# Altium project 搅拌机.PrjPcb
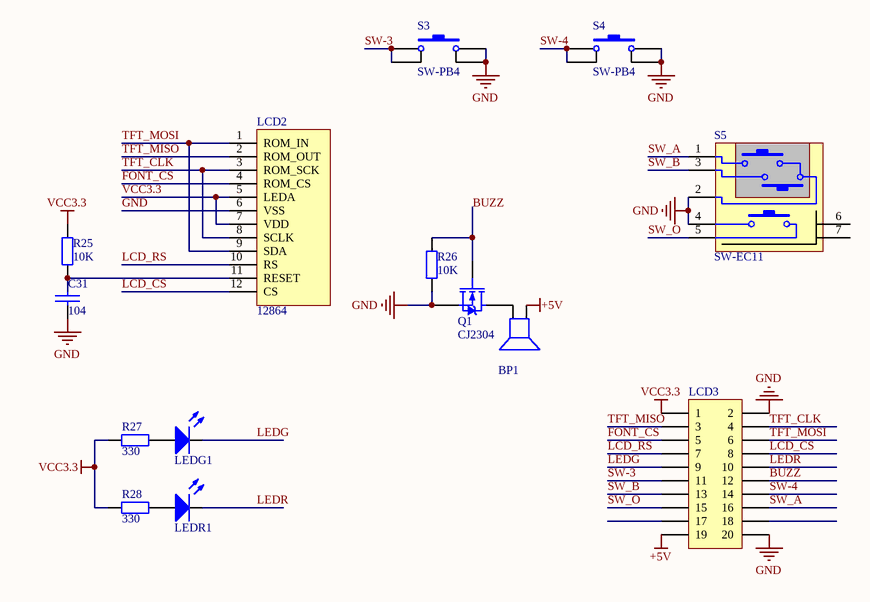
[diagram p0: 显示面板.SchDoc]
6 sheets, 247 parts. Net scope: global (net labels, ports and power ports of the same name join across sheets).
Board files: 显示面板.PcbDoc, 搅拌机主控.PcbDoc, 步进电机驱动板.PcbDoc
Sheets:
  显示面板.SchDoc
  转速检测.SchDoc
  PT100检测电路.SchDoc
  MCU.SchDoc
  搅拌驱动驱动.SchDoc
  升降电机驱动.SchDoc

## Sheet 显示面板.SchDoc
size A4

### Parts
BP1  BUZZER  [蜂鸣器]  (value not drawn)
C31  104  [0603C]
LCD2  12864  [LCD12864-1.7inch]
LCD3  LCD  [HDR10X2_A1]  (value not drawn)
LEDG1  COLOUR  [LEDφ6]  (value not drawn)
LEDR1  COLOUR  [LEDφ6]  (value not drawn)
Q1  CJ2304  [SOT-23]
R25  value 10K  [0603-1]  (hidden comment: Res1)
R26  value 10K  [0603-1]  (hidden comment: Res1)
R27  value 330  [0603-1]  (hidden comment: Res1)
R28  value 330  [0603-1]  (hidden comment: Res1)
S3  SW-PB4  [SW_PB4_A1]
S4  SW-PB4  [SW_PB4_A1]
S5  SW-EC11  [EC11]

### Nets
+5V: BP1.1(+) LCD3.19
GND: C31.1 LCD2.6(VSS) LCD3.2 LCD3.20 Q1.2(S) R26.1 S3.2 S3.3 S4.2 S4.3 S5.2 S5.4
VCC3.3: LCD2.5(LEDA) LCD2.7(VDD) LCD3.1 R25.2 R27.2 R28.2
BUZZ: LCD3.12 Q1.1(G) R26.2
FONT_CS: LCD2.4(ROM_CS) LCD3.5
LCD_CS: LCD2.12(CS) LCD3.8
LCD_RS: LCD2.10(RS) LCD3.7
LEDG: LCD3.9 LEDG1.2(-)
LEDR: LCD3.10 LEDR1.2(-)
SW-3: LCD3.11 S3.1 S3.4
SW-4: LCD3.14 S4.1 S4.4
SW_A: LCD3.16 S5.1
SW_B: LCD3.13 S5.3
SW_O: LCD3.15 S5.5
TFT_CLK: LCD2.3(ROM_SCK) LCD2.8(SCLK) LCD3.4
TFT_MISO: LCD2.2(ROM_OUT) LCD3.3
TFT_MOSI: LCD2.1(ROM_IN) LCD2.9(SDA) LCD3.6
NetBP1_2: BP1.2(-) Q1.3(D)
NetC31_2: C31.2 LCD2.11(RESET) R25.1
NetLEDG1_1: LEDG1.1(+) R27.1
NetLEDR1_1: LEDR1.1(+) R28.1

Not connected (* = marked no-connect by the designer): LCD3 17 18; S5 6 7

### Library data of the parts
BP1 = BUZZER: 蜂鸣器
C31 = CAP X: 安规电容
LCD2 = LCD12864串口屏: 1.7寸SPI12864屏; 链接: https://item.taobao.com/item.htm?id=12879087349&ali_refid=a3_430582_1006:1103967305:N:12864:66eadc08ff72364ec7fad7a9c6eab1e1&ali_trackid=1_66eadc08ff72364ec7fad7a9c6eab1e1&spm=a230r.1.14.3#detail
LCD3 = Header 10X2: Header, 10-Pin; LatestRevisionDate: 17-Jul-2002; LatestRevisionNote: Re-released for DXP Platform.; Publisher: Altium Limited
LEDG1 LEDR1 = ledφ6
Q1 = MOSFET-N: N-Channel MOSFET; PackageDocument: 1995/1996; Published: 8-Jun-2000; LatestRevisionDate: 17-Jul-2002; LatestRevisionNote: Re-released for DXP Platform.; PackageReference: E3; Publisher: Altium Limited
R25-R28 = Res1: 贴片电阻; Published: 8-Jun-2000; LatestRevisionDate: 17-Jul-2002; LatestRevisionNote: Re-released for DXP Platform.; PackageReference: AXIAL-0.4; Publisher: Altium Limited
S3 S4 = SW-PB4: 微动开关; Published: 24-Mar-1999; LatestRevisionDate: 17-Jul-2002; LatestRevisionNote: Re-released for DXP Platform.; PackageReference: SPST-2; Publisher: Altium Limited
S5 = SW-EC11: 旋转编码开关; Published: 24-Mar-1999; LatestRevisionDate: 17-Jul-2002; LatestRevisionNote: Re-released for DXP Platform.; PackageReference: SPST-2; Publisher: Altium Limited

## Sheet 转速检测.SchDoc
size A4
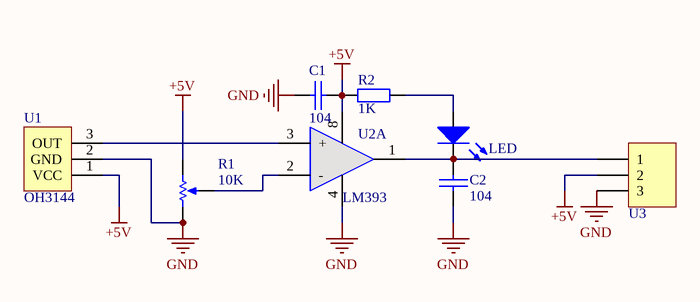
[diagram p1: 转速检测.SchDoc]

### Parts
(Parts that share a designator on the sheet are numbered #1, #2 ... from top to bottom, then left to right.)
C1#1  104  [0603C]
C2#1  104  [0603C]
LED  COLOUR  [0603LED]  (value not drawn)
R1#1  value 10K  [3x3dianweiqi]  (hidden comment: RPot)
R2#1  value 1K  [0603-1]  (hidden comment: Res1)
U1#1  OH3144  [OH3144]
U2#1  LM393  [NSO8_N]  (part A of 2)
U3#1  Header 3  [HDR3X1_A]  (value not drawn)

### Nets
+5V: C1#1.2 R1#1.3(BOT) R2#1.1 U1#1.1(VCC) U2#1.8(V+) U3#1.2
GND: C1#1.1 C2#1.1 R1#1.1(TOP) U1#1.2(GND) U2#1.4(V-) U3#1.3
NetC2#1_2: C2#1.2 LED.2(-) U2#1.1(OUT1) U3#1.1
NetLED_1: LED.1(+) R2#1.2
NetR1#1_2: R1#1.2(TAP) U2#1.2(-)
NetU1#1_3: U1#1.3(OUT) U2#1.3(+)

### Library data of the parts
C1#1 C2#1 = CAP X: 安规电容
LED = ledφ6
R1#1 = RPot: 精密可调电阻; Sim Note: Enter the Resistance value and the set point into parameter fields.; Set Position: 0.5; Published: 8-Jun-2000; LatestRevisionDate: 17-Jul-2002; LatestRevisionNote: Re-released for DXP Platform.; PackageReference: VR5; Publisher: Altium Limited
R2#1 = Res1: 贴片电阻; Published: 8-Jun-2000; LatestRevisionDate: 17-Jul-2002; LatestRevisionNote: Re-released for DXP Platform.; PackageReference: AXIAL-0.4; Publisher: Altium Limited
U1#1 = OH3144: 国产霍尔开关
U2#1 = LM393: 比较器
U3#1 = Header 3: 接插件; LatestRevisionDate: 17-Jul-2002; LatestRevisionNote: Re-released for DXP Platform.; Publisher: Altium Limited

## Sheet PT100检测电路.SchDoc
size A4
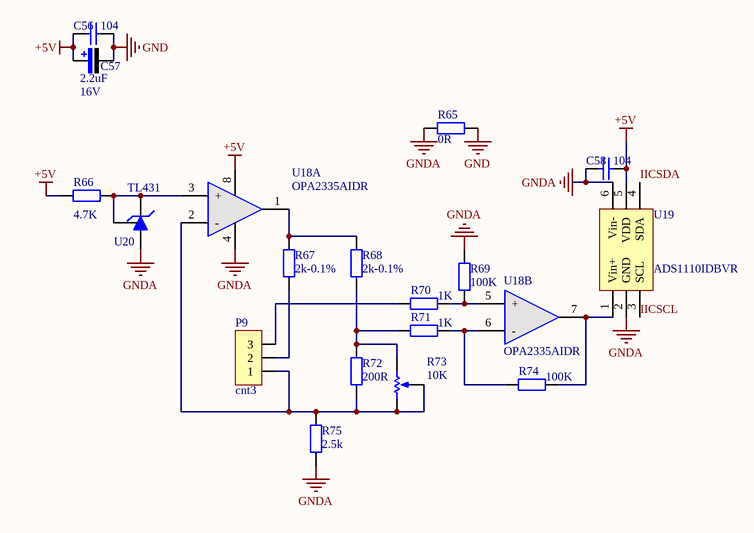
[diagram p2: PT100检测电路.SchDoc]

### Parts
C56  value 104  [C-RAD-0603]  (hidden comment: Cap)
C57  value 2.2uF  Vol: 16V  [CAP-3216]  (hidden comment: Cap Pol)
C58  value 104  [C-RAD-0603]  (hidden comment: Cap)
P9  cnt3  [7.62mmPCB接线端子3p]
R65  value 0R  [0603-1]  (hidden comment: Res1)
R66  value 4.7K  [0603-1]  (hidden comment: Res1)
R67  value 2k-0.1%  [0603-1]  (hidden comment: Res1)
R68  value 2k-0.1%  [0603-1]  (hidden comment: Res1)
R69  value 100K  [0603-1]  (hidden comment: Res1)
R70  value 1K  [0603-1]  (hidden comment: Res1)
R71  value 1K  [0603-1]  (hidden comment: Res1)
R72  value 200R  [0603-1]  (hidden comment: Res1)
R73  value 10K  [VR-3266W]  (hidden comment: RPot)
R74  value 100K  [0603-1]  (hidden comment: Res1)
R75  value 2.5k  [0603-1]  (hidden comment: Res1)
U18  OPA2335AIDR  [NSO8_N]  (parts A,B of 2)
U19  ADS1110IDBVR  [SOT23-6]
U20  TL431  [SOT23]

### Nets
+5V: C56.1 C57.1 C58.2 R66.1 U18.8(V+) U19.5(VDD)
GND: C56.2 C57.2 R65.1
GNDA: C58.1 R65.2 R69.2 R75.1 U18.4(V-) U19.2(GND) U19.6(Vin-) U20.3
IICSCL: U19.3(SCL)
IICSDA: U19.4(SDA)
NetP9_1: P9.1 R72.1 R73.1(TOP) R73.2(TAP) R75.2 U18.2(-)
NetP9_2: P9.2 R67.1
NetP9_3: P9.3 R70.1
NetR66_2: R66.2 U18.3(+) U20.1 U20.2
NetR67_2: R67.2 R68.2 U18.1(OUT1)
NetR68_1: R68.1 R71.1 R72.2 R73.3(BOT)
NetR69_1: R69.1 R70.2 U18.5(+)
NetR71_2: R71.2 R74.1 U18.6(-)
NetR74_2: R74.2 U18.7(OUT2) U19.1(Vin+)

### Library data of the parts
C56 C58 = Cap: 无极性电容; Published: 8-Jun-2000; LatestRevisionDate: 17-Jul-2002; LatestRevisionNote: Re-released for DXP Platform.; PackageReference: RAD-0.3; Publisher: Altium Limited
C57 = Cap Pol: 极性电解电容; Published: 8-Jun-2000; LatestRevisionDate: 17-Jul-2002; LatestRevisionNote: Re-released for DXP Platform.; PackageReference: RB7.6-15; Publisher: Altium Limited
P9 = cnt3: 3p接线端子
R65-R72 R74 R75 = Res1: 贴片电阻; Published: 8-Jun-2000; LatestRevisionDate: 17-Jul-2002; LatestRevisionNote: Re-released for DXP Platform.; PackageReference: AXIAL-0.4; Publisher: Altium Limited
R73 = RPot: as R1#1 on sheet 转速检测; Published: 8-Jun-2000; LatestRevisionDate: 17-Jul-2002; LatestRevisionNote: Re-released for DXP Platform.; PackageReference: VR5; Publisher: Altium Limited
U18 = AD8667: 双运放
U19 = ADS1110IDBVR: 16位内部基准AD芯片IIC

## Sheet MCU.SchDoc
size A3
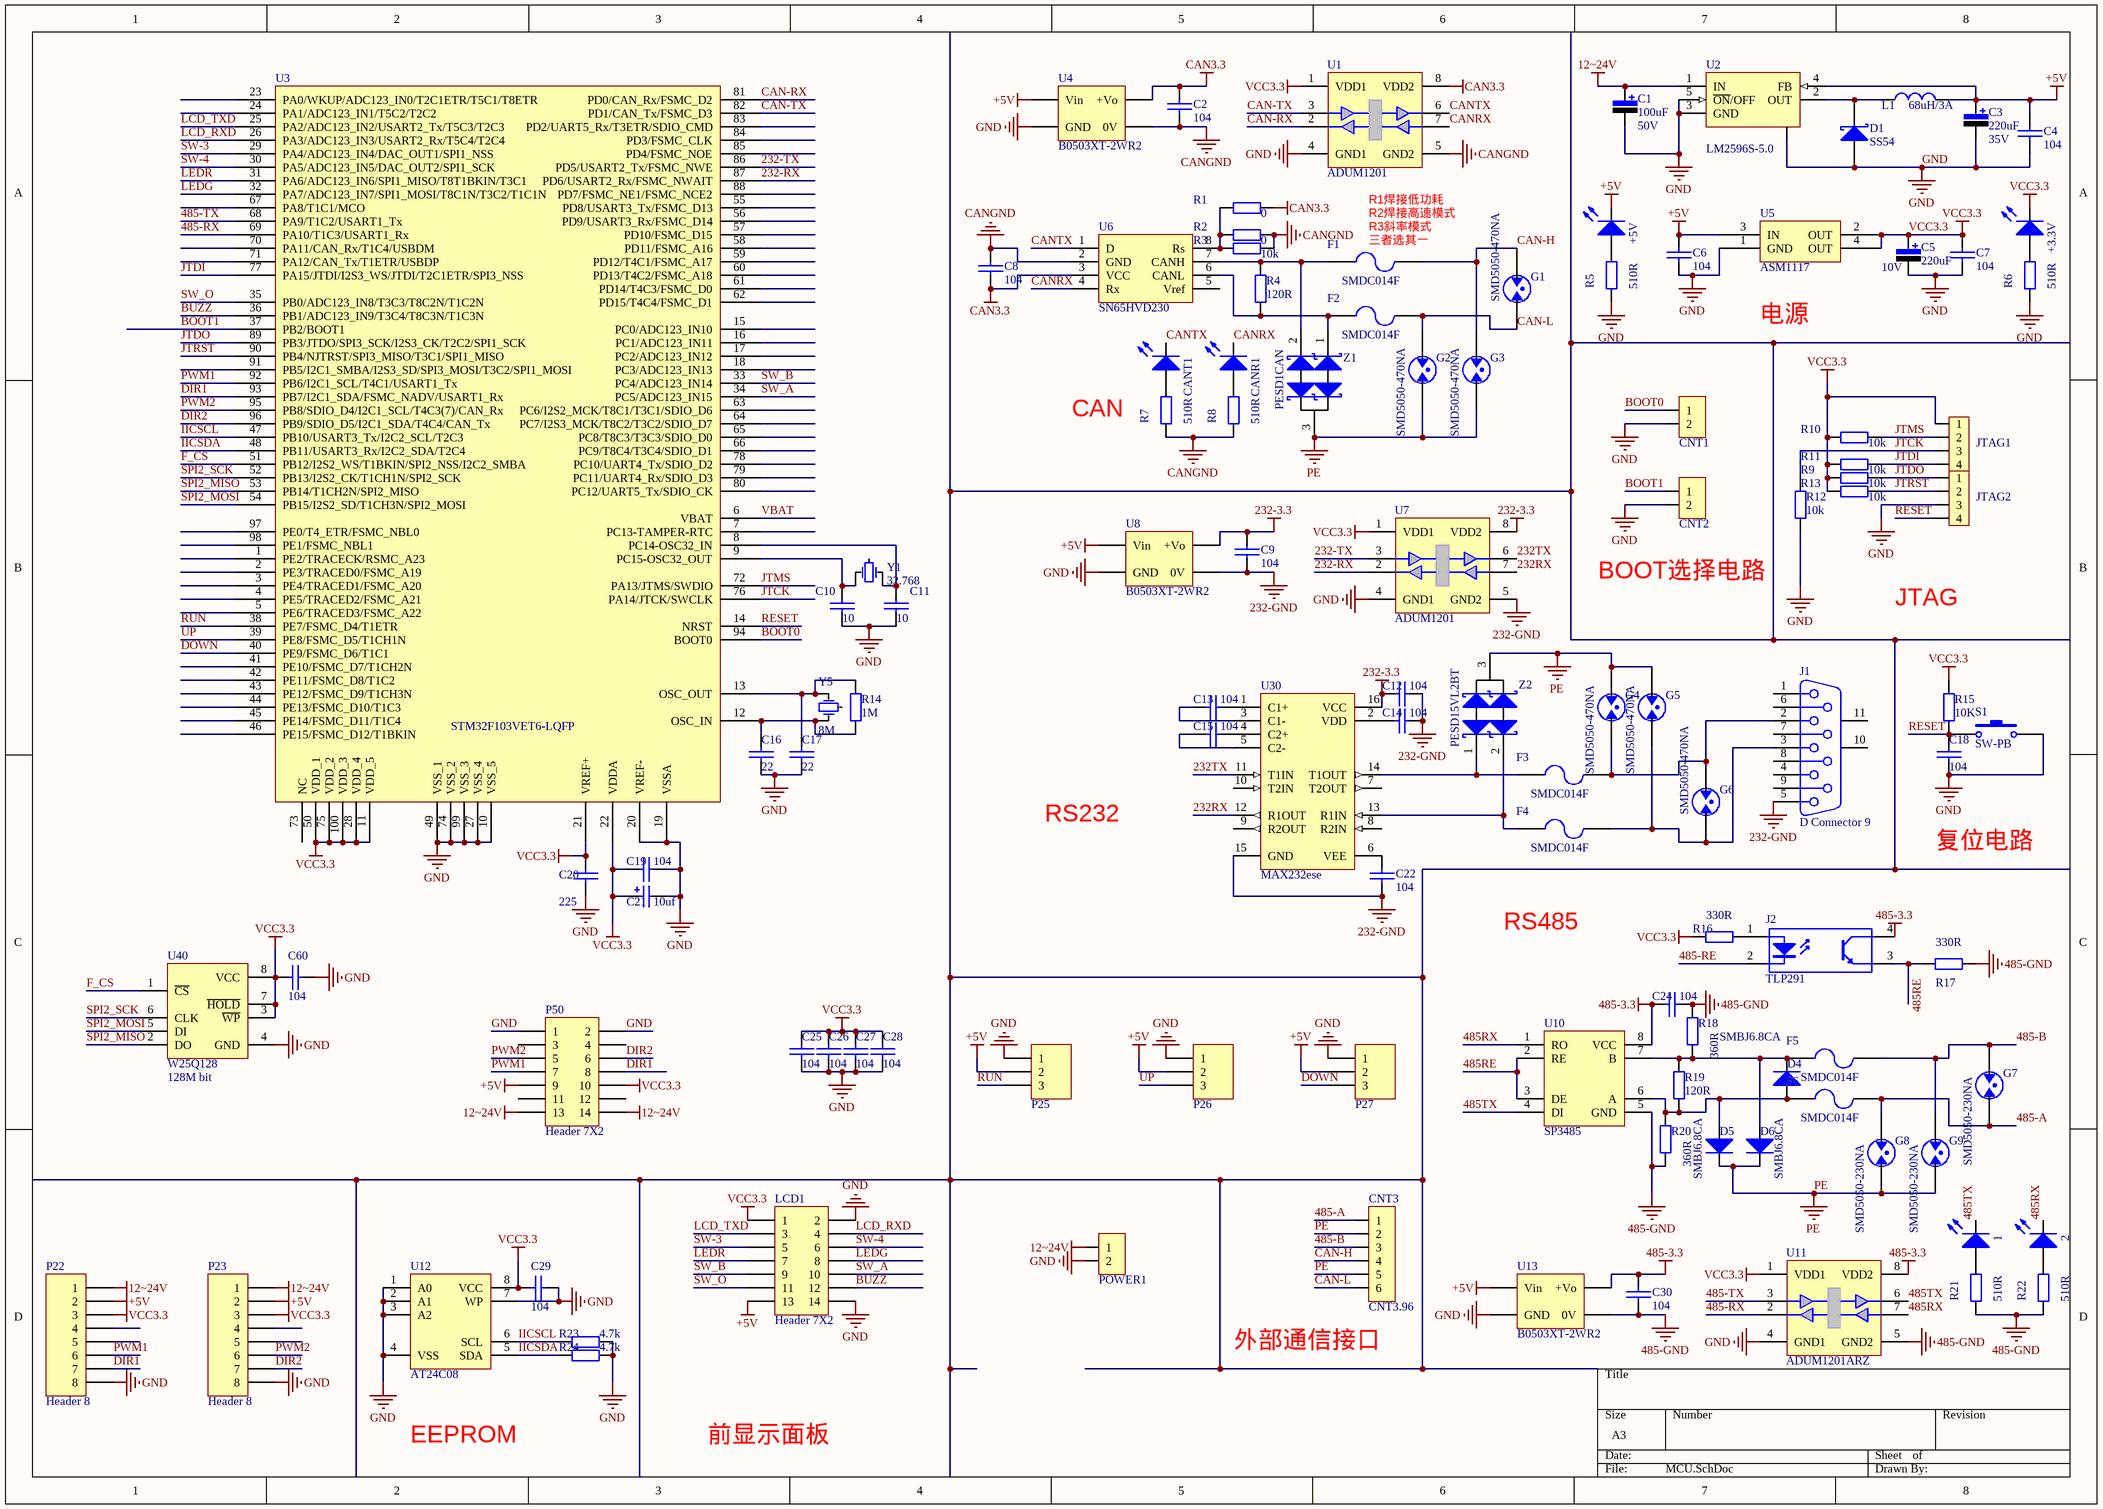
[diagram p3: MCU.SchDoc]

### Parts
(Parts that share a designator on the sheet are numbered #1, #2 ... from top to bottom, then left to right.)
1  COLOUR  [0603LED]  (value not drawn)
2  COLOUR  [0603LED]  (value not drawn)
+3.3V  COLOUR  [0603LED]  (value not drawn)
+5V  COLOUR  [0603LED]  (value not drawn)
C1#2  value 100uF  Vol: 50V  [C-RB-S10]  (hidden comment: Cap Pol)
C2#2  104  [0603C]
C3  value 220uF  Vol: 35V  [C-RB-S10]  (hidden comment: Cap Pol)
C4  104  [0603C]
C5  value 220uF  Vol: 10V  [CAP-7343]  (hidden comment: Cap Pol)
C6  104  [0603C]
C7  104  [0603C]
C8  104  [0603C]
C9  104  [0603C]
C10  10  [0603C]
C11  10  [0603C]
C12  104  [0603C]
C13  104  [0603C]
C14  104  [0603C]
C15  104  [0603C]
C16  22  [0603C]
C17  22  [0603C]
C18  104  [0603C]
C19  104  [0603C]
C20  225  [0603C]
C21  10uf  [ct3216-18]
C22  104  [0603C]
C24  104  [0603C]
C25  104  [0603C]
C26  104  [0603C]
C27  104  [0603C]
C28  104  [0603C]
C29  104  [0603C]
C30  104  [0603C]
C60  104  [0603C]
CANR1  COLOUR  [0603LED]  (value not drawn)
CANT1  COLOUR  [0603LED]  (value not drawn)
CNT1  cnt2p  [cont-1]  (value not drawn)
CNT2  cnt2p  [cont-1]  (value not drawn)
CNT3  CNT3.96  [CNT3.96]
D1  Type: SS54  [DIODE-SMA]  (hidden comment: D-Schottky)
D4  Type: SMBJ6.8CA  [DIODE-SMB]  (hidden comment: TVS)
D5  Type: SMBJ6.8CA  [DIODE-SMB]  (hidden comment: TVS)
D6  Type: SMBJ6.8CA  [DIODE-SMB]  (hidden comment: TVS)
F1  SMDC014F  [1812]
F2  value SMDC014F  [1812]  (hidden comment: Fuse)
F3  SMDC014F  [1812]
F4  value SMDC014F  [1812]  (hidden comment: Fuse)
F5  SMDC014F  [1812]
F6  value SMDC014F  [1812]  (hidden comment: Fuse)
G1  SMD5050-470NA  [SMD5050]
G2  SMD5050-470NA  [SMD5050]
G3  SMD5050-470NA  [SMD5050]
G4  SMD5050-470NA  [SMD5050]
G5  SMD5050-470NA  [SMD5050]
G6  SMD5050-470NA  [SMD5050]
G7  SMD5050-230NA  [SMD5050]
G8  SMD5050-230NA  [SMD5050]
G9  SMD5050-230NA  [SMD5050]
J1  D Connector 9  [DB9-M]
J2  TLP291  [SOP127P710X350-4N]
JTAG1  单排插针11mm4p  [单排插针2.54]  (value not drawn)
JTAG2  单排插针11mm4p  [单排插针2.54]  (value not drawn)
L1  value 68uH/3A  [L-SMD-12]  (hidden comment: Inductor)
LCD1  Header 7X2  [HDR7X2_A1]
P22  Header 8  [PH2.0-8P]
P23  Header 8  [PH2.0-8P]
P25  Header 3  [XH2.54*3卧贴]  (value not drawn)
P26  Header 3  [XH2.54*3卧贴]  (value not drawn)
P27  Header 3  [XH2.54*3卧贴]  (value not drawn)
P50  Header 7X2  [HDR7X2_A1]
POWER1  CNT5.08MM*2 WAN  [CNT5.08*2WAN]  (value not drawn)
R1#2  value 0  [0603-1]  (hidden comment: Res1)
R2#2  value 0  [0603-1]  (hidden comment: Res1)
R3  value 10k  [0603-1]  (hidden comment: Res1)
R4  value 120R  [0603-1]  (hidden comment: Res1)
R5  value 510R  [0603-1]  (hidden comment: Res1)
R6  value 510R  [0603-1]  (hidden comment: Res1)
R7  value 510R  [0603-1]  (hidden comment: Res1)
R8  value 510R  [0603-1]  (hidden comment: Res1)
R9  value 10k  [0603-1]  (hidden comment: Res1)
R10  value 10k  [0603-1]  (hidden comment: Res1)
R11  value 10k  [0603-1]  (hidden comment: Res1)
R12  value 10k  [0603-1]  (hidden comment: Res1)
R13  value 10k  [0603-1]  (hidden comment: Res1)
R14  value 1M  [0603-1]  (hidden comment: Res1)
R15  value 10K  [0603-1]  (hidden comment: Res1)
R16  value 330R  [0603-1]  (hidden comment: Res1)
R17  value 330R  [0603-1]  (hidden comment: Res1)
R18  value 360R  [0603-1]  (hidden comment: Res1)
R19  value 120R  [0603-1]  (hidden comment: Res1)
R20  value 360R  [0603-1]  (hidden comment: Res1)
R21  value 510R  [0603-1]  (hidden comment: Res1)
R22  value 510R  [0603-1]  (hidden comment: Res1)
R23  value 4.7k  [0603-1]  (hidden comment: Res1)
R24  value 4.7k  [0603-1]  (hidden comment: Res1)
S1  SW-PB  [SW_PB4_A1]
U1#2  ADUM1201  [NSO8_N]
U2#2  LM2596S-5.0  [TO-263-5]
U3#2  STM32F103VET6-LQFP  [LQFP-100_M]
U4  B0503XT-2WR2  [B_XT-2WR2]
U5  ASM1117  [SOT-223]
U6  SN65HVD230  [NSO8_N]
U7  ADUM1201  [NSO8_N]
U8  B0503XT-2WR2  [B_XT-2WR2]
U10  SP3485  [NSO8_N]
U11  ADUM1201ARZ  [NSO8_N]
U12  AT24C08  [SOIC8_N]
U13  B0503XT-2WR2  [B_XT-2WR2]
U30  MAX232ese  [NSO16_M]
U40  W25Q128  Memory: 128M bit  [SOIC8_W]
Y1  value 32.768  [MC-146]  (hidden comment: XTAL_SM)
Y5  value 8M  [xtal3225]  (hidden comment: XTAL_SM)
Z1  PESD1CAN  [SOT-23]
Z2  PESD15VL2BT  [SOT-23]

### Nets
12~24V: C1#2.1 P22.1 P23.1 P50.13 P50.14 POWER1.1 U2#2.1(IN)
232-3.3: C9.1 C12.2 U7.8(VDD2) U8.9(+Vo) U30.16(VCC)
232-GND: C9.2 C12.1 C14.1 C22.1 J1.5 U7.5(GND2) U8.8(0V) U30.15(GND)
485-3.3: C24.2 C30.1 J2.4(C) U10.8(VCC) U11.8(VDD2) U13.9(+Vo)
485-GND: C24.1 C30.2 R17.1 R18.2 R20.1 R21.1 R22.1 U10.5(GND) U11.5(GND2) U13.8(0V)
+5V: +5V.2(-) C3.1 C4.1 C6.1 L1.2 LCD1.13 P22.2 P23.2 P25.2 P26.2 P27.2 P50.9 U2#2.4(FB) U4.14(Vin) U5.3(IN) U8.14(Vin) U13.14(Vin)
CAN3.3: C2#2.1 C8.2 R1#2.1 U1#2.8(VDD2) U4.9(+Vo) U6.3(VCC)
CANGND: C2#2.2 C8.1 R2#2.1 R3.1 R7.1 R8.1 U1#2.5(GND2) U4.8(0V) U6.2(GND)
GND: C1#2.2 C3.2 C4.2 C5.2 C6.2 C7.2 C10.2 C11.2 C16.2 C17.2 C18.1 C19.1 C20.1 C21.2 C25.1 C26.1 C27.1 C28.1 C29.1 C60.1 CNT1.2 CNT2.2 D1.1(A) JTAG2.3 LCD1.2 LCD1.14 P22.8 P23.8 P25.1 P26.1 P27.1 P50.1 P50.2 POWER1.2 R5.1 R6.1 R12.2 R23.1 R24.1 S1.2 U1#2.4(GND1) U2#2.3(GND) U2#2.5(~{ON}/OFF) U2#2.6 U3#2.10(VSS_5) U3#2.19(VSSA) U3#2.20(VREF-) U3#2.27(VSS_4) U3#2.49(VSS_1) U3#2.74(VSS_2) U3#2.99(VSS_3) U4.1(GND) U5.1(GND) U7.4(GND1) U8.1(GND) U11.4(GND1) U12.1(A0) U12.2(A1) U12.3(A2) U12.4(VSS) U12.7(WP) U13.1(GND) U40.4(GND)
PE: CNT3.2 CNT3.5 D5.2(K) D6.2(K) G2.2 G3.2 G4.1 G5.1 G8.2 G9.2 Z1.3 Z2.3
VCC3.3: +3.3V.2(-) C5.1 C7.1 C19.2 C20.2 C21.1 C25.2 C26.2 C27.2 C28.2 C29.2 C60.2 JTAG1.1 LCD1.1 P22.3 P23.3 P50.10 R9.2 R10.2 R11.2 R13.2 R15.2 R16.2 U1#2.1(VDD1) U3#2.11(VDD_5) U3#2.21(VREF+) U3#2.22(VDDA) U3#2.28(VDD_4) U3#2.50(VDD_1) U3#2.75(VDD_2) U3#2.100(VDD_3) U5.2(OUT) U5.4(OUT) U7.1(VDD1) U11.1(VDD1) U12.8(VCC) U40.3(~{WP}) U40.7(~{HOLD}) U40.8(VCC)
232-RX: U3#2.87(PD6/USART2_Rx/FSMC_NWAIT) U7.2(Voa)
232-TX: U3#2.86(PD5/USART2_Tx/FSMC_NWE) U7.3(Vib)
232RX: U7.7(Via) U30.12(R1OUT)
232TX: U7.6(Vob) U30.11(T1IN)
485-A: CNT3.1 F6.2 G7.2 G8.1
485-B: CNT3.3 F5.2 G7.1 G9.1
485-RE: J2.2(K)
485-RX: U3#2.69(PA10/T1C3/USART1_Rx) U11.2(Voa)
485-TX: U3#2.68(PA9/T1C2/USART1_Tx) U11.3(Vib)
485RE: J2.3(E) R17.2 U10.2(RE) U10.3(DE)
485RX: 2.2(-) U10.1(RO) U11.7(Via)
485TX: 1.2(-) U10.4(DI) U11.6(Vob)
BOOT0: CNT1.1 U3#2.94(BOOT0)
BOOT1: CNT2.1 U3#2.37(PB2/BOOT1)
BUZZ: LCD1.12 U3#2.36(PB1/ADC123_IN9/T3C4/T8C3N/T1C3N)
CAN-H: CNT3.4 F1.2 G1.1 G3.1
CAN-L: CNT3.6 F2.2 G1.2 G2.1
CAN-RX: U1#2.2(Voa) U3#2.81(PD0/CAN_Rx/FSMC_D2)
CAN-TX: U1#2.3(Vib) U3#2.82(PD1/CAN_Tx/FSMC_D3)
CANRX: CANR1.2(-) U1#2.7(Via) U6.4(Rx)
CANTX: CANT1.2(-) U1#2.6(Vob) U6.1(D)
DIR1: P22.7 P50.8 U3#2.93(PB7/I2C1_SDA/FSMC_NADV/USART1_Rx)
DIR2: P23.7 P50.6 U3#2.96(PB9/SDIO_D5/I2C1_SDA/T4C4/CAN_Tx)
DOWN: P27.3 U3#2.40(PE9/FSMC_D6/T1C1)
F_CS: U3#2.51(PB12/I2S2_WS/T1BKIN/SPI2_NSS/I2C2_SMBA) U40.1(~{CS})
IICSCL: R23.2 U3#2.47(PB10/USART3_Tx/I2C2_SCL/T2C3) U12.6(SCL)
IICSDA: R24.2 U3#2.48(PB11/USART3_Rx/I2C2_SDA/T2C4) U12.5(SDA)
JTCK: JTAG1.3 R12.1 U3#2.76(PA14/JTCK/SWCLK)
JTDI: JTAG1.4 R11.1 U3#2.77(PA15/JTDI/I2S3_WS/JTDI/T2C1ETR/SPI3_NSS)
JTDO: JTAG2.1 R9.1 U3#2.89(PB3/JTDO/SPI3_SCK/I2S3_CK/T2C2/SPI1_SCK)
JTMS: JTAG1.2 R10.1 U3#2.72(PA13/JTMS/SWDIO)
JTRST: JTAG2.2 R13.1 U3#2.90(PB4/NJTRST/SPI3_MISO/T3C1/SPI1_MISO)
LCD_RXD: LCD1.4 U3#2.26(PA3/ADC123_IN3/USART2_Rx/T5C4/T2C4)
LCD_TXD: LCD1.3 U3#2.25(PA2/ADC123_IN2/USART2_Tx/T5C3/T2C3)
LEDG: LCD1.8 U3#2.32(PA7/ADC123_IN7/SPI1_MOSI/T8C1N/T3C2/T1C1N)
LEDR: LCD1.7 U3#2.31(PA6/ADC123_IN6/SPI1_MISO/T8T1BKIN/T3C1)
PWM1: P22.6 P50.7 U3#2.92(PB6/I2C1_SCL/T4C1/USART1_Tx)
PWM2: P23.6 P50.5 U3#2.95(PB8/SDIO_D4/I2C1_SCL/T4C3(7)/CAN_Rx)
RESET: C18.2 JTAG2.4 R15.1 S1.1 U3#2.14(NRST)
RUN: P25.3 U3#2.38(PE7/FSMC_D4/T1ETR)
SPI2_MISO: U3#2.53(PB14/T1CH2N/SPI2_MISO) U40.2(DO)
SPI2_MOSI: U3#2.54(PB15/I2S2_SD/T1CH3N/SPI2_MOSI) U40.5(DI)
SPI2_SCK: U3#2.52(PB13/I2S2_CK/T1CH1N/SPI2_SCK) U40.6(CLK)
SW-3: LCD1.5 U3#2.29(PA4/ADC123_IN4/DAC_OUT1/SPI1_NSS)
SW-4: LCD1.6 U3#2.30(PA5/ADC123_IN5/DAC_OUT2/SPI1_SCK)
SW_A: LCD1.10 U3#2.34(PC5/ADC123_IN15)
SW_B: LCD1.9 U3#2.33(PC4/ADC123_IN14)
SW_O: LCD1.11 U3#2.35(PB0/ADC123_IN8/T3C3/T8C2N/T1C2N)
UP: P26.3 U3#2.39(PE8/FSMC_D5/T1CH1N)
VBAT: U3#2.6(VBAT)
Net1_1: 1.1(+) R21.2
Net2_1: 2.1(+) R22.2
Net+3.3V_1: +3.3V.1(+) R6.2
Net+5V_1: +5V.1(+) R5.2
NetC10_1: C10.1 U3#2.9(PC15-OSC32_OUT) Y1.1(OSC1)
NetC11_1: C11.1 U3#2.8(PC14-OSC32_IN) Y1.2(OSC2)
NetC13_1: C13.1 U30.1(C1+)
NetC13_2: C13.2 U30.3(C1-)
NetC14_2: C14.2 U30.2(VDD)
NetC15_1: C15.1 U30.4(C2+)
NetC15_2: C15.2 U30.5(C2-)
NetC16_1: C16.1 R14.1 U3#2.12(OSC_IN) Y5.1(OSC1)
NetC17_1: C17.1 R14.2 U3#2.13(OSC_OUT) Y5.2(OSC2)
NetC22_2: C22.2 U30.6(VEE)
NetCANR1_1: CANR1.1(+) R8.2
NetCANT1_1: CANT1.1(+) R7.2
NetD1_2: D1.2(K) L1.1 U2#2.2(OUT)
NetD4_1: D4.1(A) D5.1(A) F6.1 R19.1 R20.2 U10.6(A)
NetD4_2: D4.2(K) D6.1(A) F5.1 R18.1 R19.2 U10.7(B)
NetF1_1: F1.1 R4.2 U6.7(CANH) Z1.2
NetF2_1: F2.1 R4.1 U6.6(CANL) Z1.1
NetF3_1: F3.1 U30.14(T1OUT) Z2.1
NetF3_2: F3.2 G4.2 G6.1 J1.2
NetF4_1: F4.1 U30.13(R1IN) Z2.2
NetF4_2: F4.2 G5.2 G6.2 J1.3
NetJ2_1: J2.1(A) R16.1
NetR1#2_2: R1#2.2 R2#2.2 R3.2 U6.8(Rs)

Not connected (* = marked no-connect by the designer): J1 1 4 6 7 8 9 10(MH1) 11(MH2); P22 4 5; P23 4 5; P50 3 4 11 12; U3#2 1(PE2/TRACECK/RSMC_A23) 2(PE3/TRACED0/FSMC_A19) 3(PE4/TRACED1/FSMC_A20) 4(PE5/TRACED2/FSMC_A21) 5(PE6/TRACED3/FSMC_A22) 7(PC13-TAMPER-RTC) 15(PC0/ADC123_IN10) 16(PC1/ADC123_IN11) 17(PC2/ADC123_IN12) 18(PC3/ADC123_IN13) 23(PA0/WKUP/ADC123_IN0/T2C1ETR/T5C1/T8ETR) 24(PA1/ADC123_IN1/T5C2/T2C2) 41(PE10/FSMC_D7/T1CH2N) 42(PE11/FSMC_D8/T1C2) 43(PE12/FSMC_D9/T1CH3N) 44(PE13/FSMC_D10/T1C3) 45(PE14/FSMC_D11/T1C4) 46(PE15/FSMC_D12/T1BKIN) 55(PD8/USART3_Tx/FSMC_D13) 56(PD9/USART3_Rx/FSMC_D14) 57(PD10/FSMC_D15) 58(PD11/FSMC_A16) 59(PD12/T4C1/FSMC_A17) 60(PD13/T4C2/FSMC_A18) 61(PD14/T4C3/FSMC_D0) 62(PD15/T4C4/FSMC_D1) 63(PC6/I2S2_MCK/T8C1/T3C1/SDIO_D6) 64(PC7/I2S3_MCK/T8C2/T3C2/SDIO_D7) 65(PC8/T8C3/T3C3/SDIO_D0) 66(PC9/T8C4/T3C4/SDIO_D1) 67(PA8/T1C1/MCO) 70(PA11/CAN_Rx/T1C4/USBDM) 71(PA12/CAN_Tx/T1ETR/USBDP) 73(NC) 78(PC10/UART4_Tx/SDIO_D2) 79(PC11/UART4_Rx/SDIO_D3) 80(PC12/UART5_Tx/SDIO_CK) 83(PD2/UART5_Rx/T3ETR/SDIO_CMD) 84(PD3/FSMC_CLK) 85(PD4/FSMC_NOE) 88(PD7/FSMC_NE1/FSMC_NCE2) 91(PB5/I2C1_SMBA/I2S3_SD/SPI3_MOSI/T3C2/SPI1_MOSI) 97(PE0/T4_ETR/FSMC_NBL0) 98(PE1/FSMC_NBL1); U6 5(Vref); U30 7(T2OUT) 8(R2IN) 9(R2OUT) 10(T2IN); Y1 3; Y5 3

### Notes on the sheet
- R1焊接低功耗
- R2焊接高速模式
- (near F1) R3斜率模式
- (near F1) 三者选其一
- 电源
- CAN
- BOOT选择电路
- JTAG
- RS232
- 复位电路
- RS485
- 外部通信接口
- EEPROM
- 前显示面板

### Library data of the parts
1 2 +3.3V +5V CANR1 CANT1 = ledφ6
C1#2 C3 C5 = Cap Pol: 极性电解电容; Published: 8-Jun-2000; LatestRevisionDate: 17-Jul-2002; LatestRevisionNote: Re-released for DXP Platform.; PackageReference: RB7.6-15; Publisher: Altium Limited
C2#2 C4 C6-C20 C22 C24-C30 C60 = CAP X: 安规电容
C21 = CAP: 电解电容
CNT3 = CNT3.96: 接线端子(3.96MM)
D1 = D-Schottky: 肖特基二极管; Published: 8-Jun-2000; LatestRevisionDate: 17-Jul-2002; LatestRevisionNote: Re-released for DXP Platform.; PackageReference: SMB; Publisher: Altium Limited; Code_JEDEC: DO-214-AA
D4-D6 = TVS: TVS保护; Published: 8-Jun-2000; LatestRevisionDate: 17-Jul-2002; LatestRevisionNote: Re-released for DXP Platform.; PackageDocument: Sep-1996; PackageReference: SMC; Publisher: Altium Limited; Code_JEDEC: DO-214-AB
F1-F6 = Fuse 2: 保险丝; Published: 8-Jun-2000; LatestRevisionDate: 17-Jul-2002; LatestRevisionNote: Re-released for DXP Platform.; PackageReference: PIN-W2/E2.8; Publisher: Altium Limited
  F1 F3 F5: Value: SMDC014F
G1-G9 = SMD5050-230NA: 230V 气体放电管
J1 = D Connector 9: 串口; PackageDocument: O; Positions: 9; Gender: Receptacle; Published: 15-Jun-2001; LatestRevisionDate: 17-Jul-2002; LatestRevisionNote: Re-released for DXP Platform.; DatasheetDocument: 1-Sep-1999; PackageReference: 788750; Publisher: Altium Limited; Orientation: Right Angle
J2 = TLP281: 光耦; Published: 24-Mar-1999; LatestRevisionDate: 04-Mar-2005; LatestRevisionNote: Sch pins 3 & 4 Swapped.; DatasheetDocument: Nov-2003; PackageReference: DIP-4; Publisher: Altium Limited
L1 = Inductor: 电感; Code_IEC: 1005; Published: 8-Jun-2000; LatestRevisionDate: 17-Jul-2002; LatestRevisionNote: Re-released for DXP Platform.; PackageReference: 0402-A; Publisher: Altium Limited; Code_JEITA: 0402
LCD1 P50 = Header 7X2: Header, 7-Pin; LatestRevisionDate: 17-Jul-2002; LatestRevisionNote: Re-released for DXP Platform.; Publisher: Altium Limited
P22 P23 = Header 8: Header, 8-Pin; LatestRevisionDate: 17-Jul-2002; LatestRevisionNote: Re-released for DXP Platform.; Publisher: Altium Limited
P25-P27 = Header 3: 接插件; LatestRevisionDate: 17-Jul-2002; LatestRevisionNote: Re-released for DXP Platform.; Publisher: Altium Limited
R1#2 R2#2 R3-R24 = Res1: 贴片电阻; Published: 8-Jun-2000; LatestRevisionDate: 17-Jul-2002; LatestRevisionNote: Re-released for DXP Platform.; PackageReference: AXIAL-0.4; Publisher: Altium Limited
S1 = SW-PB: 微动开关; Published: 24-Mar-1999; LatestRevisionDate: 17-Jul-2002; LatestRevisionNote: Re-released for DXP Platform.; PackageReference: SPST-2; Publisher: Altium Limited
U1#2 U7 U11 = ADUM1201: ADI隔离芯片
U2#2 = LM2596S-5.0: 5V稳压芯片; Note: Tab is connected to GND; Published: 15-Apr-2002; DatasheetVersion: Dec-1997; PackageReference: TS5B; Publisher: Altium Limited; PackageDescription: D2-PAK; 5 Leads; Body 14.4 (inc. leads) x 10.4 mm (LxW max); ComponentLink1Description: Manufacturer Link; ComponentLink1URL: http://www.national.com/; ComponentLink2Description: Datasheet; ComponentLink2URL: http://www.national.com/ds.cgi/LM/LM2596.pdf; ComponentLink3Description: URL Link1; ComponentLink3URL: http://www.national.com/pf/LM/LM2596.html
U3#2 = STM32F103V: STM32单片机100引脚
U4 U8 U13 = B0503D-2WR2: 5v-3.3v-2w隔离电源
U5 = ASM1117: 3.3V稳压芯片
U6 = SN65HVD230: CAN芯片
U10 = SP3485: 485总线芯片
U12 = AT24C02: EEROM存储器
U30 = MAX232: +5V Powered, Multi-Channel RS-232 Driver/Receiver; Published: 16-Jan-2001; LatestRevisionDate: 13-Apr-2006; LatestRevisionNote: IPC-7351 Footprint Added.; PackageReference: NSO16; Publisher: Altium Limited; PackageDescription: 16-Pin Small Outline Integrated Circuit 1.27 mm Pitch; Code_JEDEC: MS-012-AC; Code_IPC: SOIC127P600-16; ComponentLink1Description: Manufacturer Link; ComponentLink1URL: http://www.maxim-ic.com/; ComponentLink2Description: Datasheet; ComponentLink2URL: http://pdfserv.maxim-ic.com/en/ds/MAX220-MAX249.pdf
U40 = W25QXX: SPI FLASH
Y1 Y5 = XTAL_SM: 圆柱晶振; Published: 8-Jun-2000; LatestRevisionDate: 17-Jul-2002; LatestRevisionNote: Re-released for DXP Platform.; PackageReference: R38; Publisher: Altium Limited
Z1 Z2 = PESD1CAN: 过压保护

## Sheet 搅拌驱动驱动.SchDoc
size A4
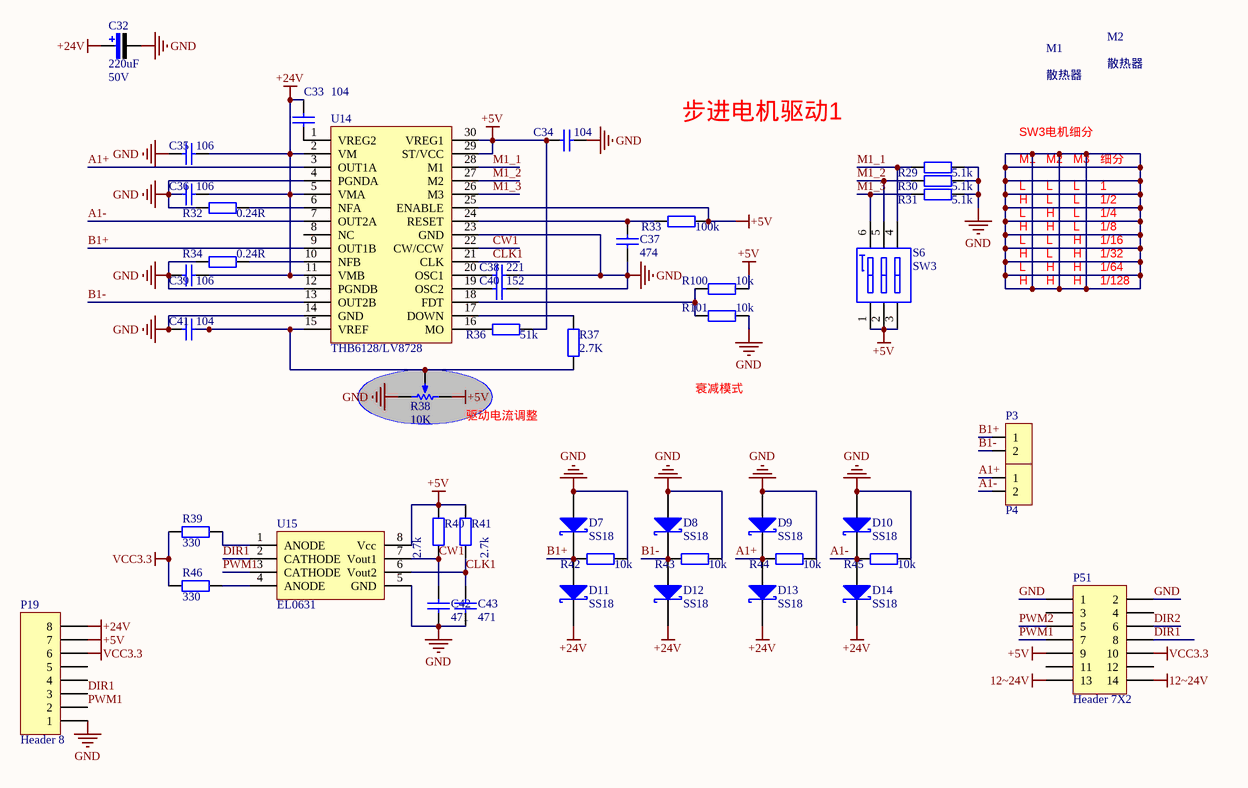
[diagram p4: 搅拌驱动驱动.SchDoc]

### Parts
C32  value 220uF  Vol: 50V  [C-RB-S10]  (hidden comment: Cap Pol)
C33  value 104  [C-RAD-0603]  (hidden comment: Cap)
C34  value 104  [C-RAD-0603]  (hidden comment: Cap)
C35  value 106  [C-RAD-0603]  (hidden comment: Cap)
C36  value 106  [C-RAD-0603]  (hidden comment: Cap)
C37  value 474  [C-RAD-0603]  (hidden comment: Cap)
C38  value 221  [C-RAD-0603]  (hidden comment: Cap)
C39  value 106  [C-RAD-0603]  (hidden comment: Cap)
C40  value 152  [C-RAD-0603]  (hidden comment: Cap)
C41  value 104  [C-RAD-0603]  (hidden comment: Cap)
C42  value 471  [C-RAD-0603]  (hidden comment: Cap)
C43  value 471  [C-RAD-0603]  (hidden comment: Cap)
D7  Type: SS18  [DIODE-SMA]  (hidden comment: D-Schottky)
D8  Type: SS18  [DIODE-SMA]  (hidden comment: D-Schottky)
D9  Type: SS18  [DIODE-SMA]  (hidden comment: D-Schottky)
D10  Type: SS18  [DIODE-SMA]  (hidden comment: D-Schottky)
D11  Type: SS18  [DIODE-SMA]  (hidden comment: D-Schottky)
D12  Type: SS18  [DIODE-SMA]  (hidden comment: D-Schottky)
D13  Type: SS18  [DIODE-SMA]  (hidden comment: D-Schottky)
D14  Type: SS18  [DIODE-SMA]  (hidden comment: D-Schottky)
M1  散热器  [26*26*10对角37.5]
M2  散热器  [26*26*10对角37.5]
P3  cnt2p  [接线端子5mm间距2p]  (value not drawn)
P4  cnt2p  [接线端子5mm间距2p]  (value not drawn)
P19  Header 8  [PH2.0-8P]
P51  Header 7X2  [HDR7X2_A1]
R29  value 5.1k  [0603-1]  (hidden comment: Res1)
R30  value 5.1k  [0603-1]  (hidden comment: Res1)
R31  value 5.1k  [0603-1]  (hidden comment: Res1)
R32  value 0.24R  [2512]  (hidden comment: Res1)
R33  value 100k  [0603-1]  (hidden comment: Res1)
R34  value 0.24R  [2512]  (hidden comment: Res1)
R36  value 51k  [0603-1]  (hidden comment: Res1)
R37  value 2.7K  [0603-1]  (hidden comment: Res1)
R38  value 10K  [VR-3266W]  (hidden comment: RPot)
R39  value 330  [0603-1]  (hidden comment: Res1)
R40  value 2.7k  [0603-1]  (hidden comment: Res1)
R41  value 2.7k  [0603-1]  (hidden comment: Res1)
R42  value 10k  [0603-1]  (hidden comment: Res1)
R43  value 10k  [0603-1]  (hidden comment: Res1)
R44  value 10k  [0603-1]  (hidden comment: Res1)
R45  value 10k  [0603-1]  (hidden comment: Res1)
R46  value 330  [0603-1]  (hidden comment: Res1)
R100  value 10k  [0603-1]  (hidden comment: Res1)
R101  value 10k  [0603-1]  (hidden comment: Res1)
S6  SW3  [SW6_3BIT]
U14  THB6128/LV8728  [SIOC-30-W]
U15  EL0631  [EL0631]

### Nets
12~24V: P51.13 P51.14
+5V: C34.1 P19.7 P51.9 R33.2 R36.2 R38.1(TOP) R40.2 R41.2 R100.2 S6.1 S6.2 S6.3 U14.25(ENABLE) U14.29(ST/VCC) U14.30(VREG1) U15.8(Vcc)
+24V: C32.1 C33.1 C35.2 C36.2 C39.2 D11.2(K) D12.2(K) D13.2(K) D14.2(K) P19.8 U14.2(VM) U14.5(VMA) U14.11(VMB)
GND: C32.2 C34.2 C35.1 C36.1 C37.1 C38.2 C39.1 C40.2 C41.1 C42.1 C43.1 D7.1(A) D8.1(A) D9.1(A) D10.1(A) P19.1 P51.1 P51.2 R29.2 R30.2 R31.2 R32.1 R34.2 R38.3(BOT) R42.2 R43.2 R44.2 R45.2 R101.2 U14.4(PGNDA) U14.12(PGNDB) U14.14(GND) U14.23(GND) U15.5(GND)
VCC3.3: P19.6 P51.10 R39.2 R46.2
A1+: D9.2(K) D13.1(A) P4.1 R44.1 U14.3(OUT1A)
A1-: D10.2(K) D14.1(A) P4.2 R45.1 U14.7(OUT2A)
B1+: D7.2(K) D11.1(A) P3.1 R42.1 U14.9(OUT1B)
B1-: D8.2(K) D12.1(A) P3.2 R43.1 U14.13(OUT2B)
CLK1: C43.2 R41.1 U14.21(CLK) U15.6(Vout2)
CW1: C42.2 R40.1 U14.22(CW/CCW) U15.7(Vout1)
DIR1: P19.3 P51.8 U15.2(CATHODE)
DIR2: P51.6
M1_1: R29.1 S6.4 U14.28(M1)
M1_2: R30.1 S6.5 U14.27(M2)
M1_3: R31.1 S6.6 U14.26(M3)
PWM1: P19.2 P51.7 U15.3(CATHODE)
PWM2: P51.5
NetC33_2: C33.2 U14.1(VREG2)
NetC37_2: C37.2 R33.1 U14.24(RESET)
NetC38_1: C38.1 U14.20(OSC1)
NetC40_1: C40.1 U14.19(OSC2)
NetC41_2: C41.2 R37.2 R38.2(TAP) U14.15(VREF)
NetR32_2: R32.2 U14.6(NFA)
NetR34_1: R34.1 U14.10(NFB)
NetR36_1: R36.1 U14.16(MO)
NetR37_1: R37.1 U14.17(DOWN)
NetR39_1: R39.1 U15.1(ANODE)
NetR46_1: R46.1 U15.4(ANODE)
NetR100_1: R100.1 R101.1 U14.18(FDT)

Not connected (* = marked no-connect by the designer): P19 4 5; P51 3 4 11 12; U14 8(NC)

### Notes on the sheet
- 步进电机驱动1
- M1
- L
- SW3电机细分
- M2
- M3
- 细分
- 1
- H
- 1/2
- 1/4
- 1/8
- 1/16
- 1/32
- 1/64
- 1/128
- 衰减模式
- (near R38) 驱动电流调整

### Library data of the parts
C32 = Cap Pol: 极性电解电容; Published: 8-Jun-2000; LatestRevisionDate: 17-Jul-2002; LatestRevisionNote: Re-released for DXP Platform.; PackageReference: RB7.6-15; Publisher: Altium Limited
C33-C43 = Cap: 无极性电容; Published: 8-Jun-2000; LatestRevisionDate: 17-Jul-2002; LatestRevisionNote: Re-released for DXP Platform.; PackageReference: RAD-0.3; Publisher: Altium Limited
D7-D14 = D-Schottky: 肖特基二极管; Published: 8-Jun-2000; LatestRevisionDate: 17-Jul-2002; LatestRevisionNote: Re-released for DXP Platform.; PackageReference: SMB; Publisher: Altium Limited; Code_JEDEC: DO-214-AA
M1 M2 = 26*26*10散热器: 26*26*10MM散热器孔距37MM; 链接: https://item.taobao.com/item.htm?spm=a1z10.5-c.w4002-16073799567.19.6c7860d7hcre0b&id=550027229822
P19 = Header 8: Header, 8-Pin; LatestRevisionDate: 17-Jul-2002; LatestRevisionNote: Re-released for DXP Platform.; Publisher: Altium Limited
P51 = Header 7X2: Header, 7-Pin; LatestRevisionDate: 17-Jul-2002; LatestRevisionNote: Re-released for DXP Platform.; Publisher: Altium Limited
R29-R34 R36 R37 R39-R46 R100 R101 = Res1: 贴片电阻; Published: 8-Jun-2000; LatestRevisionDate: 17-Jul-2002; LatestRevisionNote: Re-released for DXP Platform.; PackageReference: AXIAL-0.4; Publisher: Altium Limited
R38 = RPot: as R1#1 on sheet 转速检测; Published: 8-Jun-2000; LatestRevisionDate: 17-Jul-2002; LatestRevisionNote: Re-released for DXP Platform.; PackageReference: VR5; Publisher: Altium Limited
S6 = SW3: 3位编码开关
U14 = THB6128: 步进电机驱动
U15 = EL0631: 双路隔离光耦

## Sheet 升降电机驱动.SchDoc
size A4
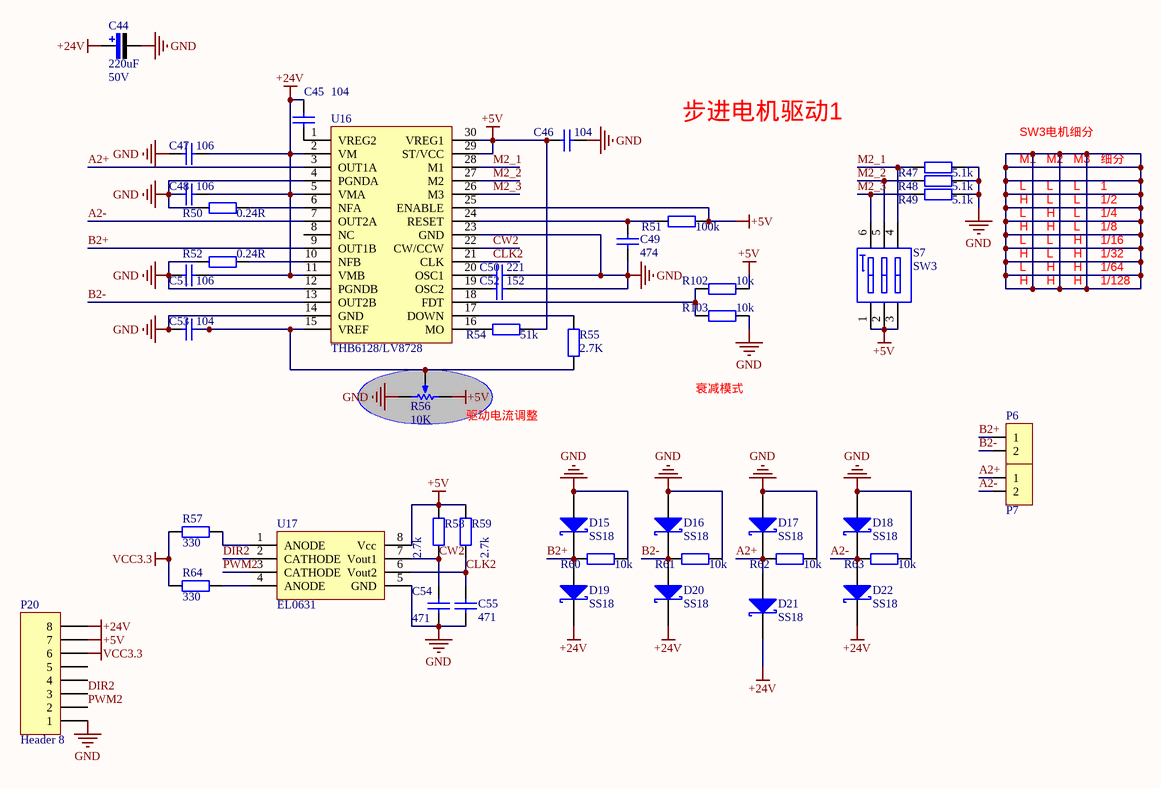
[diagram p5: 升降电机驱动.SchDoc]

### Parts
C44  value 220uF  Vol: 50V  [C-RB-S10]  (hidden comment: Cap Pol)
C45  value 104  [C-RAD-0603]  (hidden comment: Cap)
C46  value 104  [C-RAD-0603]  (hidden comment: Cap)
C47  value 106  [C-RAD-0603]  (hidden comment: Cap)
C48  value 106  [C-RAD-0603]  (hidden comment: Cap)
C49  value 474  [C-RAD-0603]  (hidden comment: Cap)
C50  value 221  [C-RAD-0603]  (hidden comment: Cap)
C51  value 106  [C-RAD-0603]  (hidden comment: Cap)
C52  value 152  [C-RAD-0603]  (hidden comment: Cap)
C53  value 104  [C-RAD-0603]  (hidden comment: Cap)
C54  value 471  [C-RAD-0603]  (hidden comment: Cap)
C55  value 471  [C-RAD-0603]  (hidden comment: Cap)
D15  Type: SS18  [DIODE-SMA]  (hidden comment: D-Schottky)
D16  Type: SS18  [DIODE-SMA]  (hidden comment: D-Schottky)
D17  Type: SS18  [DIODE-SMA]  (hidden comment: D-Schottky)
D18  Type: SS18  [DIODE-SMA]  (hidden comment: D-Schottky)
D19  Type: SS18  [DIODE-SMA]  (hidden comment: D-Schottky)
D20  Type: SS18  [DIODE-SMA]  (hidden comment: D-Schottky)
D21  Type: SS18  [DIODE-SMA]  (hidden comment: D-Schottky)
D22  Type: SS18  [DIODE-SMA]  (hidden comment: D-Schottky)
P6  cnt2p  [接线端子5mm间距2p]  (value not drawn)
P7  cnt2p  [接线端子5mm间距2p]  (value not drawn)
P20  Header 8  [PH2.0-8P]
R47  value 5.1k  [0603-1]  (hidden comment: Res1)
R48  value 5.1k  [0603-1]  (hidden comment: Res1)
R49  value 5.1k  [0603-1]  (hidden comment: Res1)
R50  value 0.24R  [2512]  (hidden comment: Res1)
R51  value 100k  [0603-1]  (hidden comment: Res1)
R52  value 0.24R  [2512]  (hidden comment: Res1)
R54  value 51k  [0603-1]  (hidden comment: Res1)
R55  value 2.7K  [0603-1]  (hidden comment: Res1)
R56  value 10K  [VR-3266W]  (hidden comment: RPot)
R57  value 330  [0603-1]  (hidden comment: Res1)
R58  value 2.7k  [0603-1]  (hidden comment: Res1)
R59  value 2.7k  [0603-1]  (hidden comment: Res1)
R60  value 10k  [0603-1]  (hidden comment: Res1)
R61  value 10k  [0603-1]  (hidden comment: Res1)
R62  value 10k  [0603-1]  (hidden comment: Res1)
R63  value 10k  [0603-1]  (hidden comment: Res1)
R64  value 330  [0603-1]  (hidden comment: Res1)
R102  value 10k  [0603-1]  (hidden comment: Res1)
R103  value 10k  [0603-1]  (hidden comment: Res1)
S7  SW3  [SW6_3BIT]
U16  THB6128/LV8728  [SIOC-30-W]
U17  EL0631  [EL0631]

### Nets
+5V: C46.1 P20.7 R51.2 R54.2 R56.1(TOP) R58.2 R59.2 R102.2 S7.1 S7.2 S7.3 U16.25(ENABLE) U16.29(ST/VCC) U16.30(VREG1) U17.8(Vcc)
+24V: C44.1 C45.1 C47.2 C48.2 C51.2 D19.2(K) D20.2(K) D21.2(K) D22.2(K) P20.8 U16.2(VM) U16.5(VMA) U16.11(VMB)
GND: C44.2 C46.2 C47.1 C48.1 C49.1 C50.2 C51.1 C52.2 C53.1 C54.1 C55.1 D15.1(A) D16.1(A) D17.1(A) D18.1(A) P20.1 R47.2 R48.2 R49.2 R50.1 R52.2 R56.3(BOT) R60.2 R61.2 R62.2 R63.2 R103.2 U16.4(PGNDA) U16.12(PGNDB) U16.14(GND) U16.23(GND) U17.5(GND)
VCC3.3: P20.6 R57.2 R64.2
A2+: D17.2(K) D21.1(A) P7.1 R62.1 U16.3(OUT1A)
A2-: D18.2(K) D22.1(A) P7.2 R63.1 U16.7(OUT2A)
B2+: D15.2(K) D19.1(A) P6.1 R60.1 U16.9(OUT1B)
B2-: D16.2(K) D20.1(A) P6.2 R61.1 U16.13(OUT2B)
CLK2: C55.2 R59.1 U16.21(CLK) U17.6(Vout2)
CW2: C54.2 R58.1 U16.22(CW/CCW) U17.7(Vout1)
DIR2: P20.3 U17.2(CATHODE)
M2_1: R47.1 S7.4 U16.28(M1)
M2_2: R48.1 S7.5 U16.27(M2)
M2_3: R49.1 S7.6 U16.26(M3)
PWM2: P20.2 U17.3(CATHODE)
NetC45_2: C45.2 U16.1(VREG2)
NetC49_2: C49.2 R51.1 U16.24(RESET)
NetC50_1: C50.1 U16.20(OSC1)
NetC52_1: C52.1 U16.19(OSC2)
NetC53_2: C53.2 R55.2 R56.2(TAP) U16.15(VREF)
NetR50_2: R50.2 U16.6(NFA)
NetR52_1: R52.1 U16.10(NFB)
NetR54_1: R54.1 U16.16(MO)
NetR55_1: R55.1 U16.17(DOWN)
NetR57_1: R57.1 U17.1(ANODE)
NetR64_1: R64.1 U17.4(ANODE)
NetR102_1: R102.1 R103.1 U16.18(FDT)

Not connected (* = marked no-connect by the designer): P20 4 5; U16 8(NC)

### Notes on the sheet
- 步进电机驱动1
- M1
- L
- SW3电机细分
- M2
- M3
- 细分
- 1
- H
- 1/2
- 1/4
- 1/8
- 1/16
- 1/32
- 1/64
- 1/128
- 衰减模式
- (near R56) 驱动电流调整

### Library data of the parts
C44 = Cap Pol: 极性电解电容; Published: 8-Jun-2000; LatestRevisionDate: 17-Jul-2002; LatestRevisionNote: Re-released for DXP Platform.; PackageReference: RB7.6-15; Publisher: Altium Limited
C45-C55 = Cap: 无极性电容; Published: 8-Jun-2000; LatestRevisionDate: 17-Jul-2002; LatestRevisionNote: Re-released for DXP Platform.; PackageReference: RAD-0.3; Publisher: Altium Limited
D15-D22 = D-Schottky: 肖特基二极管; Published: 8-Jun-2000; LatestRevisionDate: 17-Jul-2002; LatestRevisionNote: Re-released for DXP Platform.; PackageReference: SMB; Publisher: Altium Limited; Code_JEDEC: DO-214-AA
P20 = Header 8: Header, 8-Pin; LatestRevisionDate: 17-Jul-2002; LatestRevisionNote: Re-released for DXP Platform.; Publisher: Altium Limited
R47-R52 R54 R55 R57-R64 R102 R103 = Res1: 贴片电阻; Published: 8-Jun-2000; LatestRevisionDate: 17-Jul-2002; LatestRevisionNote: Re-released for DXP Platform.; PackageReference: AXIAL-0.4; Publisher: Altium Limited
R56 = RPot: as R1#1 on sheet 转速检测; Published: 8-Jun-2000; LatestRevisionDate: 17-Jul-2002; LatestRevisionNote: Re-released for DXP Platform.; PackageReference: VR5; Publisher: Altium Limited
S7 = SW3: 3位编码开关
U16 = THB6128: 步进电机驱动
U17 = EL0631: 双路隔离光耦

## Nets that join several sheets
12~24V: MCU (7 pins), 搅拌驱动驱动 (P51.13 P51.14)
+5V: 显示面板 (BP1.1 LCD3.19), 转速检测 (6 pins), PT100检测电路 (6 pins), MCU (17 pins), 搅拌驱动驱动 (16 pins), 升降电机驱动 (15 pins)
+24V: 搅拌驱动驱动 (13 pins), 升降电机驱动 (13 pins)
GND: 显示面板 (12 pins), 转速检测 (6 pins), PT100检测电路 (C56.2 C57.2 R65.1), MCU (63 pins), 搅拌驱动驱动 (34 pins), 升降电机驱动 (32 pins)
VCC3.3: 显示面板 (6 pins), MCU (39 pins), 搅拌驱动驱动 (P19.6 P51.10 R39.2 R46.2), 升降电机驱动 (P20.6 R57.2 R64.2)
BUZZ: 显示面板 (LCD3.12 Q1.1 R26.2), MCU (LCD1.12 U3#2.36)
DIR1: MCU (P22.7 P50.8 U3#2.93), 搅拌驱动驱动 (P19.3 P51.8 U15.2)
DIR2: MCU (P23.7 P50.6 U3#2.96), 搅拌驱动驱动 (P51.6), 升降电机驱动 (P20.3 U17.2)
IICSCL: PT100检测电路 (U19.3), MCU (R23.2 U3#2.47 U12.6)
IICSDA: PT100检测电路 (U19.4), MCU (R24.2 U3#2.48 U12.5)
LEDG: 显示面板 (LCD3.9 LEDG1.2), MCU (LCD1.8 U3#2.32)
LEDR: 显示面板 (LCD3.10 LEDR1.2), MCU (LCD1.7 U3#2.31)
PWM1: MCU (P22.6 P50.7 U3#2.92), 搅拌驱动驱动 (P19.2 P51.7 U15.3)
PWM2: MCU (P23.6 P50.5 U3#2.95), 搅拌驱动驱动 (P51.5), 升降电机驱动 (P20.2 U17.3)
SW-3: 显示面板 (LCD3.11 S3.1 S3.4), MCU (LCD1.5 U3#2.29)
SW-4: 显示面板 (LCD3.14 S4.1 S4.4), MCU (LCD1.6 U3#2.30)
SW_A: 显示面板 (LCD3.16 S5.1), MCU (LCD1.10 U3#2.34)
SW_B: 显示面板 (LCD3.13 S5.3), MCU (LCD1.9 U3#2.33)
SW_O: 显示面板 (LCD3.15 S5.5), MCU (LCD1.11 U3#2.35)